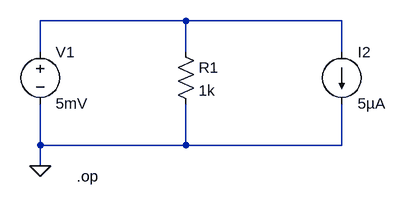
[diagram p0: schematic simple3.asc]
simple3.asc, the LTspice schematic file:
Version 4
SHEET 1 880 680
WIRE 288 208 64 208
WIRE 528 208 288 208
WIRE 64 256 64 208
WIRE 288 256 288 208
WIRE 528 256 528 208
WIRE 64 400 64 336
WIRE 288 400 288 336
WIRE 288 400 64 400
WIRE 528 400 528 336
WIRE 528 400 288 400
WIRE 64 432 64 400
FLAG 64 432 0
SYMBOL voltage 64 240 R0
SYMATTR InstName V1
SYMATTR Value 5mV
SYMBOL res 272 240 R0
SYMATTR InstName R1
SYMATTR Value 1k
SYMBOL current 528 256 R0
SYMATTR InstName I2
SYMATTR Value 5µA
TEXT 120 448 Left 2 !.op

The netlist it stands for:
* simple3.asc
V1 N001 0 5mV
R1 N001 0 1k
I2 N001 0 5µA
.op
.backanno
.end